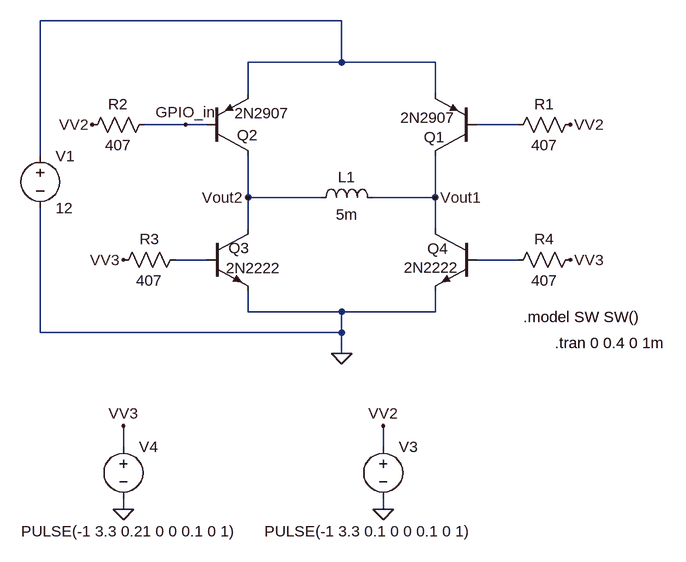
[diagram p0: schematic H-Bridge circuit.asc]
H-Bridge circuit.asc, the LTspice schematic file:
Version 4
SHEET 1 988 1152
WIRE 416 144 -48 144
WIRE 416 208 416 144
WIRE 416 208 272 208
WIRE 560 208 416 208
WIRE 272 256 272 208
WIRE 560 256 560 208
WIRE 176 304 112 304
WIRE 208 304 176 304
WIRE 688 304 624 304
WIRE -48 352 -48 144
WIRE 272 416 272 352
WIRE 384 416 272 416
WIRE 560 416 560 352
WIRE 560 416 464 416
WIRE 272 464 272 416
WIRE 560 464 560 416
WIRE 208 512 160 512
WIRE 688 512 624 512
WIRE 272 592 272 560
WIRE 416 592 272 592
WIRE 560 592 560 560
WIRE 560 592 416 592
WIRE -48 624 -48 432
WIRE 416 624 416 592
WIRE 416 624 -48 624
WIRE 416 656 416 624
WIRE 80 800 80 768
WIRE 480 800 480 768
WIRE 80 896 80 880
WIRE 480 896 480 880
FLAG 416 656 0
FLAG 480 896 0
FLAG 80 896 0
FLAG 480 768 VV2
FLAG 80 768 VV3
FLAG 768 512 VV3
FLAG 80 512 VV3
FLAG 768 304 VV2
FLAG 32 304 VV2
FLAG 560 416 Vout1
FLAG 272 416 Vout2
FLAG 176 304 GPIO_in
SYMBOL pnp 624 352 R180
WINDOW 0 49 29 Left 2
WINDOW 3 33 59 Left 2
SYMATTR InstName Q1
SYMATTR Value 2N2907
SYMBOL pnp 208 352 M180
WINDOW 0 47 32 Left 2
WINDOW 3 43 66 Left 2
SYMATTR InstName Q2
SYMATTR Value 2N2907
SYMBOL npn 208 464 R0
WINDOW 0 34 30 Left 2
WINDOW 3 30 61 Left 2
SYMATTR InstName Q3
SYMATTR Value 2N2222
SYMBOL npn 624 464 M0
WINDOW 0 44 31 Left 2
WINDOW 3 27 60 Left 2
SYMATTR InstName Q4
SYMATTR Value 2N2222
SYMBOL res 784 288 R90
WINDOW 0 0 56 VBottom 2
WINDOW 3 32 56 VTop 2
SYMATTR InstName R1
SYMATTR Value 407
SYMBOL res 128 288 R90
WINDOW 0 0 56 VBottom 2
WINDOW 3 32 56 VTop 2
SYMATTR InstName R2
SYMATTR Value 407
SYMBOL res 176 496 R90
WINDOW 0 0 56 VBottom 2
WINDOW 3 32 56 VTop 2
SYMATTR InstName R3
SYMATTR Value 407
SYMBOL res 784 496 R90
WINDOW 0 0 56 VBottom 2
WINDOW 3 32 56 VTop 2
SYMATTR InstName R4
SYMATTR Value 407
SYMBOL ind 368 432 R270
WINDOW 0 32 56 VTop 2
WINDOW 3 5 56 VBottom 2
SYMATTR InstName L1
SYMATTR Value 5m
SYMBOL voltage 480 784 R0
WINDOW 3 -183 146 Left 2
WINDOW 123 0 0 Left 2
WINDOW 39 0 0 Left 2
SYMATTR Value PULSE(-1 3.3 0.1 0 0 0.1 0 1)
SYMATTR InstName V3
SYMBOL voltage 80 784 R0
WINDOW 3 -157 146 Left 2
WINDOW 123 0 0 Left 2
WINDOW 39 0 0 Left 2
SYMATTR Value PULSE(-1 3.3 0.21 0 0 0.1 0 1)
SYMATTR InstName V4
SYMBOL voltage -48 336 R0
WINDOW 123 0 0 Left 2
WINDOW 39 0 0 Left 2
SYMATTR InstName V1
SYMATTR Value 12
TEXT 696 600 Left 2 !.model SW SW()
TEXT 744 640 Left 2 !.tran 0 0.4 0 1m

The netlist it stands for:
* H-Bridge circuit.asc
Q1 Vout1 N002 N001 0 2N2907
Q2 Vout2 GPIO_in N001 0 2N2907
Q3 Vout2 N003 0 0 2N2222
Q4 Vout1 N004 0 0 2N2222
R1 VV2 N002 407
R2 GPIO_in VV2 407
R3 N003 VV3 407
R4 VV3 N004 407
L1 Vout2 Vout1 5m
V3 VV2 0 PULSE(-1 3.3 0.1 0 0 0.1 0 1)
V4 VV3 0 PULSE(-1 3.3 0.21 0 0 0.1 0 1)
V1 N001 0 12
.model NPN NPN
.model PNP PNP
.lib standard.bjt
.model SW SW()
.tran 0 0.4 0 1m
.backanno
.end